# EAGLE schematic Sending end(2) (EAGLE 6.3)
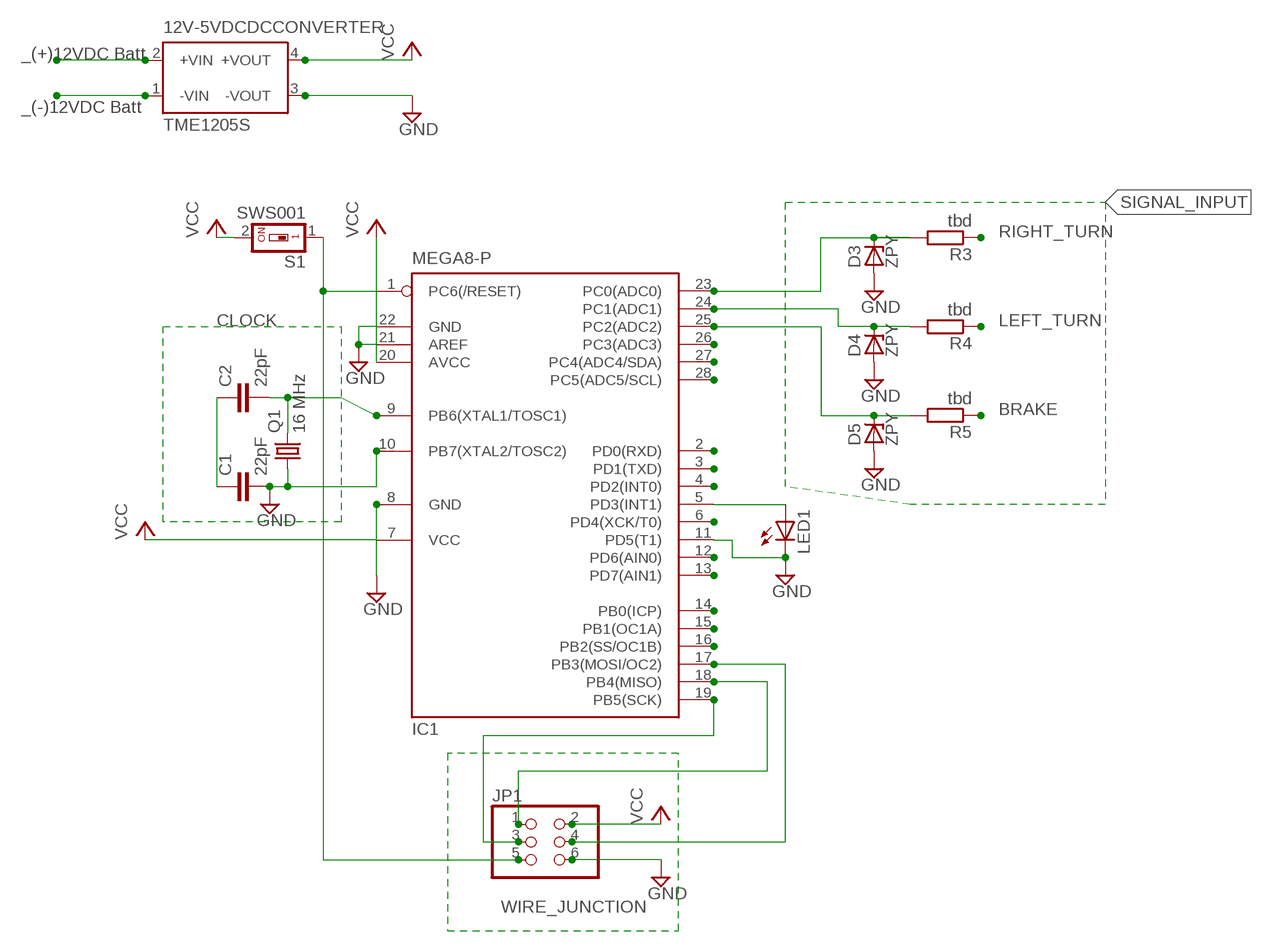
[diagram p0: schematic, sheet 1]

## Parts
12V-5VDCDCCONVERTER  TME1205S  [TME]
C1  22pF  C-EUC1210  [C1210]
C2  22pF  C-EUC1210  [C1210]
D3  ZPY  [DO41Z10]
D4  ZPY  [DO41Z10]
D5  ZPY  [DO41Z10]
IC1  MEGA8-P  [DIL28-3]
JP1  PINHD-2X3  [2X03]
LED1  LEDCHIP-LED0603  [CHIP-LED0603]
Q1  16 MHz  CRYSTALHC49S  [HC49/S]
R3  tbd  R-EU_M0805  [M0805]
R4  tbd  R-EU_M0805  [M0805]
R5  tbd  R-EU_M0805  [M0805]
S1  SWS001  [SMS-001]

## Nets
BRAKE: R5.1
GND: 12V-5VDCDCCONVERTER.3(-VOUT) C1.2 D3.A D4.A D5.A IC1.8(GND) IC1.10(PB7(XTAL2/TOSC2)) IC1.11(PD5(T1)) IC1.21(AREF) IC1.22(GND) JP1.6 LED1.C Q1.1
LEFT_TURN: R4.1
N$1: C1.1 C2.1
N$2: C2.2 IC1.9(PB6(XTAL1/TOSC1)) Q1.2
N$3: IC1.5(PD3(INT1)) LED1.A
N$7: IC1.1(PC6(/RESET)) JP1.5 S1.1
N$8: D3.C IC1.23(PC0(ADC0)) R3.2
N$9: D4.C IC1.24(PC1(ADC1)) R4.2
N$10: D5.C IC1.25(PC2(ADC2)) R5.2
N$11: IC1.26(PC3(ADC3))
N$12: IC1.27(PC4(ADC4/SDA))
N$13: IC1.28(PC5(ADC5/SCL))
N$14: IC1.2(PD0(RXD))
N$15: IC1.3(PD1(TXD))
N$16: IC1.4(PD2(INT0))
N$17: IC1.6(PD4(XCK/T0))
N$18: IC1.12(PD6(AIN0))
N$19: IC1.13(PD7(AIN1))
N$20: IC1.14(PB0(ICP))
N$21: IC1.15(PB1(OC1A))
N$22: IC1.16(PB2(SS/OC1B))
N$23: IC1.17(PB3(MOSI/OC2)) JP1.4
N$24: IC1.18(PB4(MISO)) JP1.1
N$25: IC1.19(PB5(SCK)) JP1.3
N$27: 12V-5VDCDCCONVERTER.2(+VIN)
N$28: 12V-5VDCDCCONVERTER.1(-VIN)
RIGHT_TURN: R3.1
VCC: 12V-5VDCDCCONVERTER.4(+VOUT) IC1.7(VCC) IC1.20(AVCC) JP1.2 S1.2

## Notes on the sheet
- _(+)12VDC Batt
- _(-)12VDC Batt

## Library data of the parts
12V-5VDCDCCONVERTER = traco-electronic:TME?*: DC/DC Converter TME Series 1 Watt Source: www.tracopower.com .. tme.pdf; MPN: TME 1205S; OC_FARNELL: 1007542; OC_NEWARK: 51R5325
C1 C2 = rcl:C-EU: CAPACITOR, European symbol
D3-D5 = diode:ZPY: Z DIODE 1 W
IC1 = atmel:MEGA8-P: MICROCONTROLLER 8 Kbytes FLASH, 1 kbytes SRAM, 512 bytes EEPROM, USART, 4-channel 10 bit ADC, 2-channel 8 bit ADC Pin compatible with Atmega48, ATMega88, ATMega168 Source: avr.lbr; OC_FARNELL: unknown; OC_NEWARK: unknown
JP1 = pinhead:PINHD-2X3: PIN HEADER
LED1 = led:LED: LED OSRAM: - CHIPLED LG R971, LG N971, LY N971, LG Q971, LY Q971, LO R971, LY R971 LH N974, LH R974 LS Q976, LO Q976, LY Q976 LO Q996 - Hyper CHIPLED LW Q18S LB Q993, LB Q99A, LB R99A - SideLED LS A670, LO A670, LY A670, LG A670, LP A670 LB A673, LV A673, LT A673, LW A673 LH A674 LY A675 LS A676, LA A676, LO A676, LY A676, LW A676 LS A679, LY A679, LG A679 - Hyper Micro SIDELED® LS Y876, LA Y876, LO Y876, LY Y876 LT Y87S - SmartLED LW L88C, LW L88S LB L89C, LB L89S, LG L890 LS L89K, LO L89K, LY L89K LS L896, LA L896, LO L896, LY L896 - TOPLED LS T670, LO T670, LY T670, LG T670, LP T670 LSG T670, LSP T670, LSY T670, LOP T670, LYG T670 LG T671, LOG T671, LSG T671 LB T673, LV T673, LT T673, LW T673 LH T674 LS T676, LA T676, LO T676, LY T676, LB T676, LH T676, LSB T676, LW T676 LB T67C, LV T67C, LT T67C, LS T67K, LO T67K, LY T67K, LW E67C LS E67B, LA E67B, LO E67B, LY E67B, LB E67C, LV E67C, LT E67C LW T67C LS T679, LY T679, LG T679 LS T770, LO T770, LY T770, LG T770, LP T770 LB T773, LV T773, LT T773, LW T773 LH T774 LS E675, LA E675, LY E675, LS T675 LS T776, LA T776, LO T776, LY T776, LB T776 LHGB T686 LT T68C, LB T68C - Hyper Mini TOPLED® LB M676 - Mini TOPLED Santana® LG M470 LS M47K, LO M47K, LY M47K Source: http://www.osram.convergy.de LUXEON: - LUMILED® LXK2-PW12-R00, LXK2-PW12-S00, LXK2-PW14-U00, LXK2-PW14-V00 LXK2-PM12-R00, LXK2-PM12-S00, LXK2-PM14-U00 LXK2-PE12-Q00, LXK2-PE12-R00, LXK2-PE12-S00, LXK2-PE14-T00, LXK2-PE14-U00 LXK2-PB12-K00, LXK2-PB12-L00, LXK2-PB12-M00, LXK2-PB14-N00, LXK2-PB14-P00, LXK2-PB14-Q00 LXK2-PR12-L00, LXK2-PR12-M00, LXK2-PR14-Q00, LXK2-PR14-R00 LXK2-PD12-Q00, LXK2-PD12-R00, LXK2-PD12-S00 LXK2-PH12-R00, LXK2-PH12-S00 LXK2-PL12-P00, LXK2-PL12-Q00, LXK2-PL12-R00 Source: www.luxeon.com KINGBRIGHT: KA-3528ASYC Source: www.kingbright.com
Q1 = crystal:CRYSTAL: CRYSTAL; OC_FARNELL: 1667008; OC_NEWARK: unknown
R3-R5 = resistor:R-EU_: RESISTOR, European symbol
S1 = smd-special:SWS001: SMD Dip Switch 1 pol.